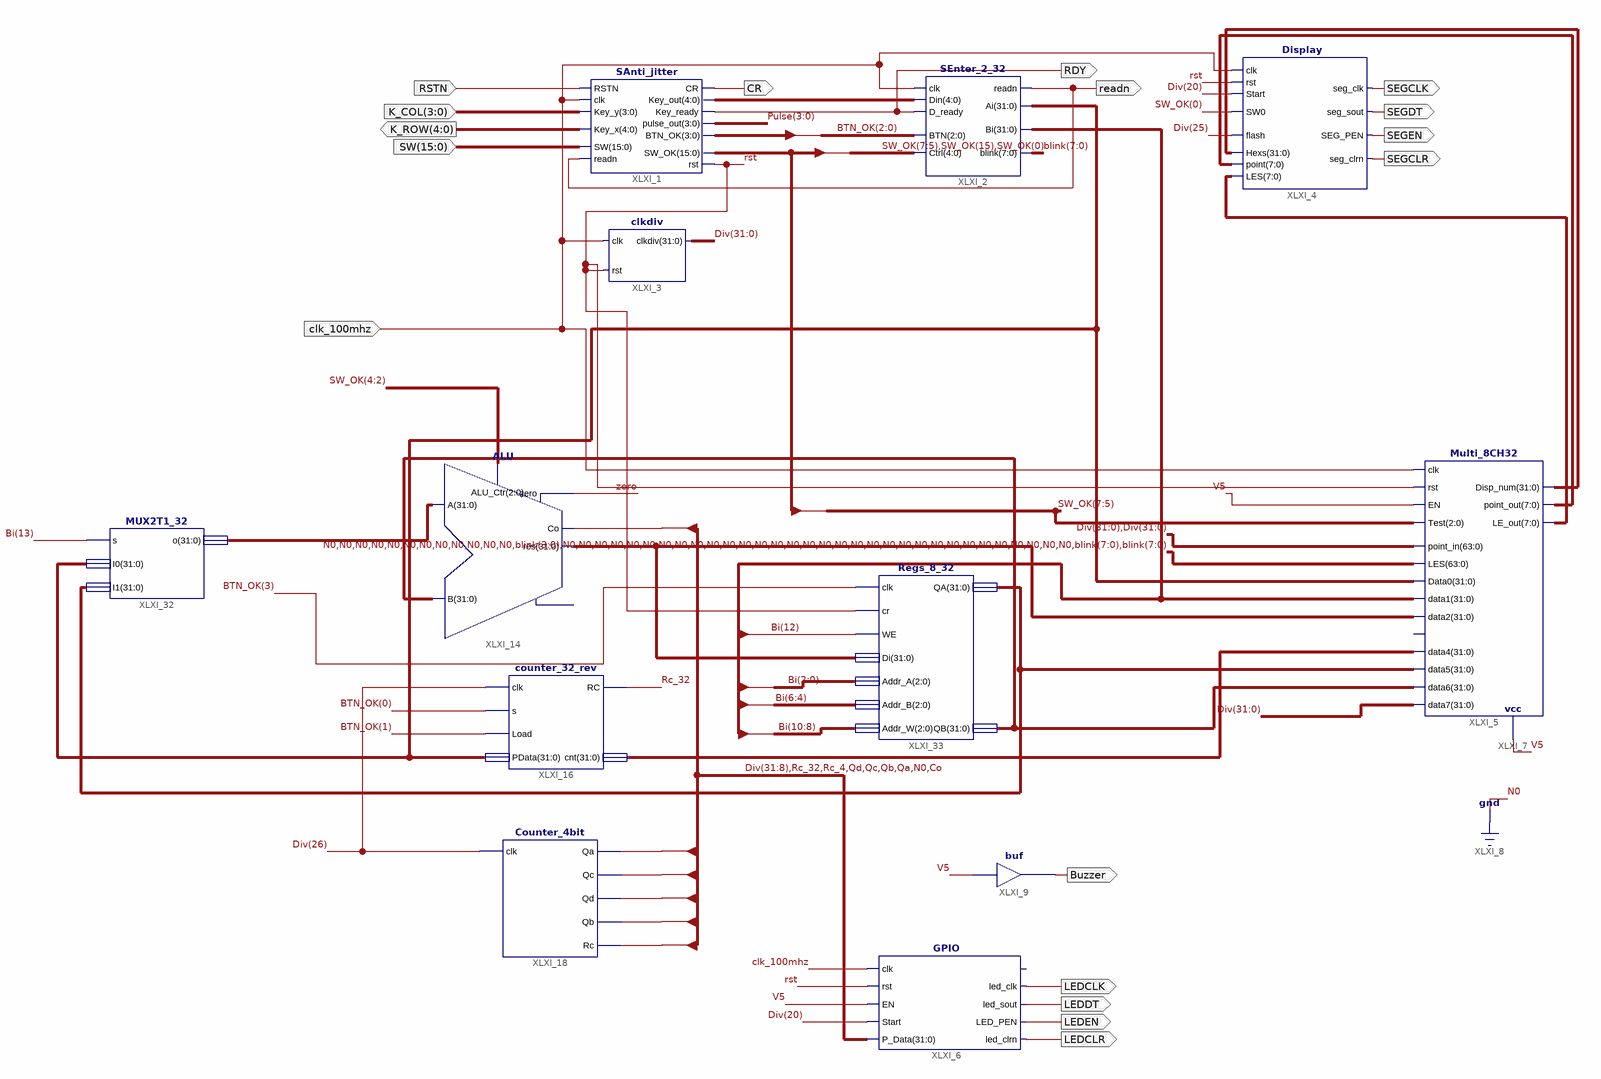
[diagram p0: schematic sheet 1]
// Xilinx ISE schematic TOP_FSM.sch (kintex7) as structural Verilog: 12 symbols, 17 ports
module TOP_FSM (
  input  RSTN,
  input  [3:0] K_COL,
  input  [15:0] SW,
  input  clk_100mhz,
  output [4:0] K_ROW,
  output readn,
  output CR,
  output RDY,
  output SEGEN,
  output SEGDT,
  output SEGCLR,
  output SEGCLK,
  output Buzzer,
  output LEDCLR,
  output LEDEN,
  output LEDDT,
  output LEDCLK
);

  wire Co, Qa, Qb, Qc, Qd, Rc_4, Rc_32, rst, zero;
  wire [3:0] BTN_OK, Pulse;
  wire [4:0] XLXN_10;
  wire [7:0] blink, XLXN_27, XLXN_29;
  wire [15:0] SW_OK;
  wire [31:0] Bi, Div, XLXN_30, XLXN_125, XLXN_240, XLXN_257, XLXN_259, XLXN_260, XLXN_261;

  SAnti_jitter XLXI_1 (
    .SW(SW), .readn(readn), .Key_y(K_COL), .Key_x(K_ROW), .RSTN(RSTN), .clk(clk_100mhz), .Key_out(XLXN_10),
    .Key_ready(RDY), .CR(CR), .rst(rst), .SW_OK(SW_OK), .pulse_out(Pulse), .BTN_OK(BTN_OK));
  SEnter_2_32 XLXI_2 (
    .readn(readn), .Ai(XLXN_259), .Bi(Bi), .blink(blink), .Din(XLXN_10), .D_ready(RDY), .clk(clk_100mhz),
    .Ctrl({SW_OK[7:5], SW_OK[15], SW_OK[0]}), .BTN(BTN_OK[2:0]));
  clkdiv XLXI_3 (.rst(rst), .clkdiv(Div), .clk(clk_100mhz));
  Display XLXI_4 (
    .LES(XLXN_27), .SEG_PEN(SEGEN), .seg_sout(SEGDT), .seg_clrn(SEGCLR), .point(XLXN_29), .Hexs(XLXN_30),
    .SW0(SW_OK[0]), .flash(Div[25]), .seg_clk(SEGCLK), .clk(clk_100mhz), .rst(rst), .Start(Div[20]));
  buf XLXI_9 (Buzzer, 1'b1);
  ALU XLXI_14 (
    .A(XLXN_257), .B(XLXN_261), .res(XLXN_125), .zero(zero), .Co(Co), .ALU_Ctr(SW_OK[4:2]));  // open: overflow
  counter_32_rev XLXI_16 (.clk(Div[26]), .s(BTN_OK[0]), .Load(BTN_OK[1]), .PData(XLXN_259), .RC(Rc_32), .cnt(XLXN_240));
  Counter_4bit XLXI_18 (.clk(Div[26]), .Qa(Qa), .Qc(Qc), .Qd(Qd), .Qb(Qb), .Rc(Rc_4));
  Multi_8CH32 XLXI_5 (
    .Test(SW_OK[7:5]), .point_in({Div, Div}), .EN(1'b1), .clk(clk_100mhz), .rst(rst),
    .LES({{12{1'b0}}, blink[3:0], {32{1'b0}}, blink, blink}), .Data0(XLXN_259), .data1(Bi), .data2(XLXN_125),
    .data4(XLXN_240), .data5(XLXN_260), .data6(XLXN_261), .data7(Div), .point_out(XLXN_29), .LE_out(XLXN_27),
    .Disp_num(XLXN_30));  // open: data3
  MUX2T1_32 XLXI_32 (.s(Bi[13]), .I0(XLXN_259), .I1(XLXN_260), .o(XLXN_257));
  Regs_8_32 XLXI_33 (
    .clk(BTN_OK[3]), .cr(rst), .WE(Bi[12]), .Di(XLXN_125), .Addr_A(Bi[2:0]), .Addr_B(Bi[6:4]),
    .Addr_W(Bi[10:8]), .QA(XLXN_260), .QB(XLXN_261));
  GPIO XLXI_6 (
    .clk(clk_100mhz), .P_Data({Div[31:8], Rc_32, Rc_4, Qd, Qc, Qb, Qa, 1'b0, Co}), .rst(rst), .EN(1'b1),
    .Start(Div[20]), .led_clrn(LEDCLR), .led_clk(LEDCLK), .led_sout(LEDDT), .LED_PEN(LEDEN));  // open: GPIOf0
endmodule
